# EAGLE design X13_Power_Distribution_B (EAGLE 9.6.2)
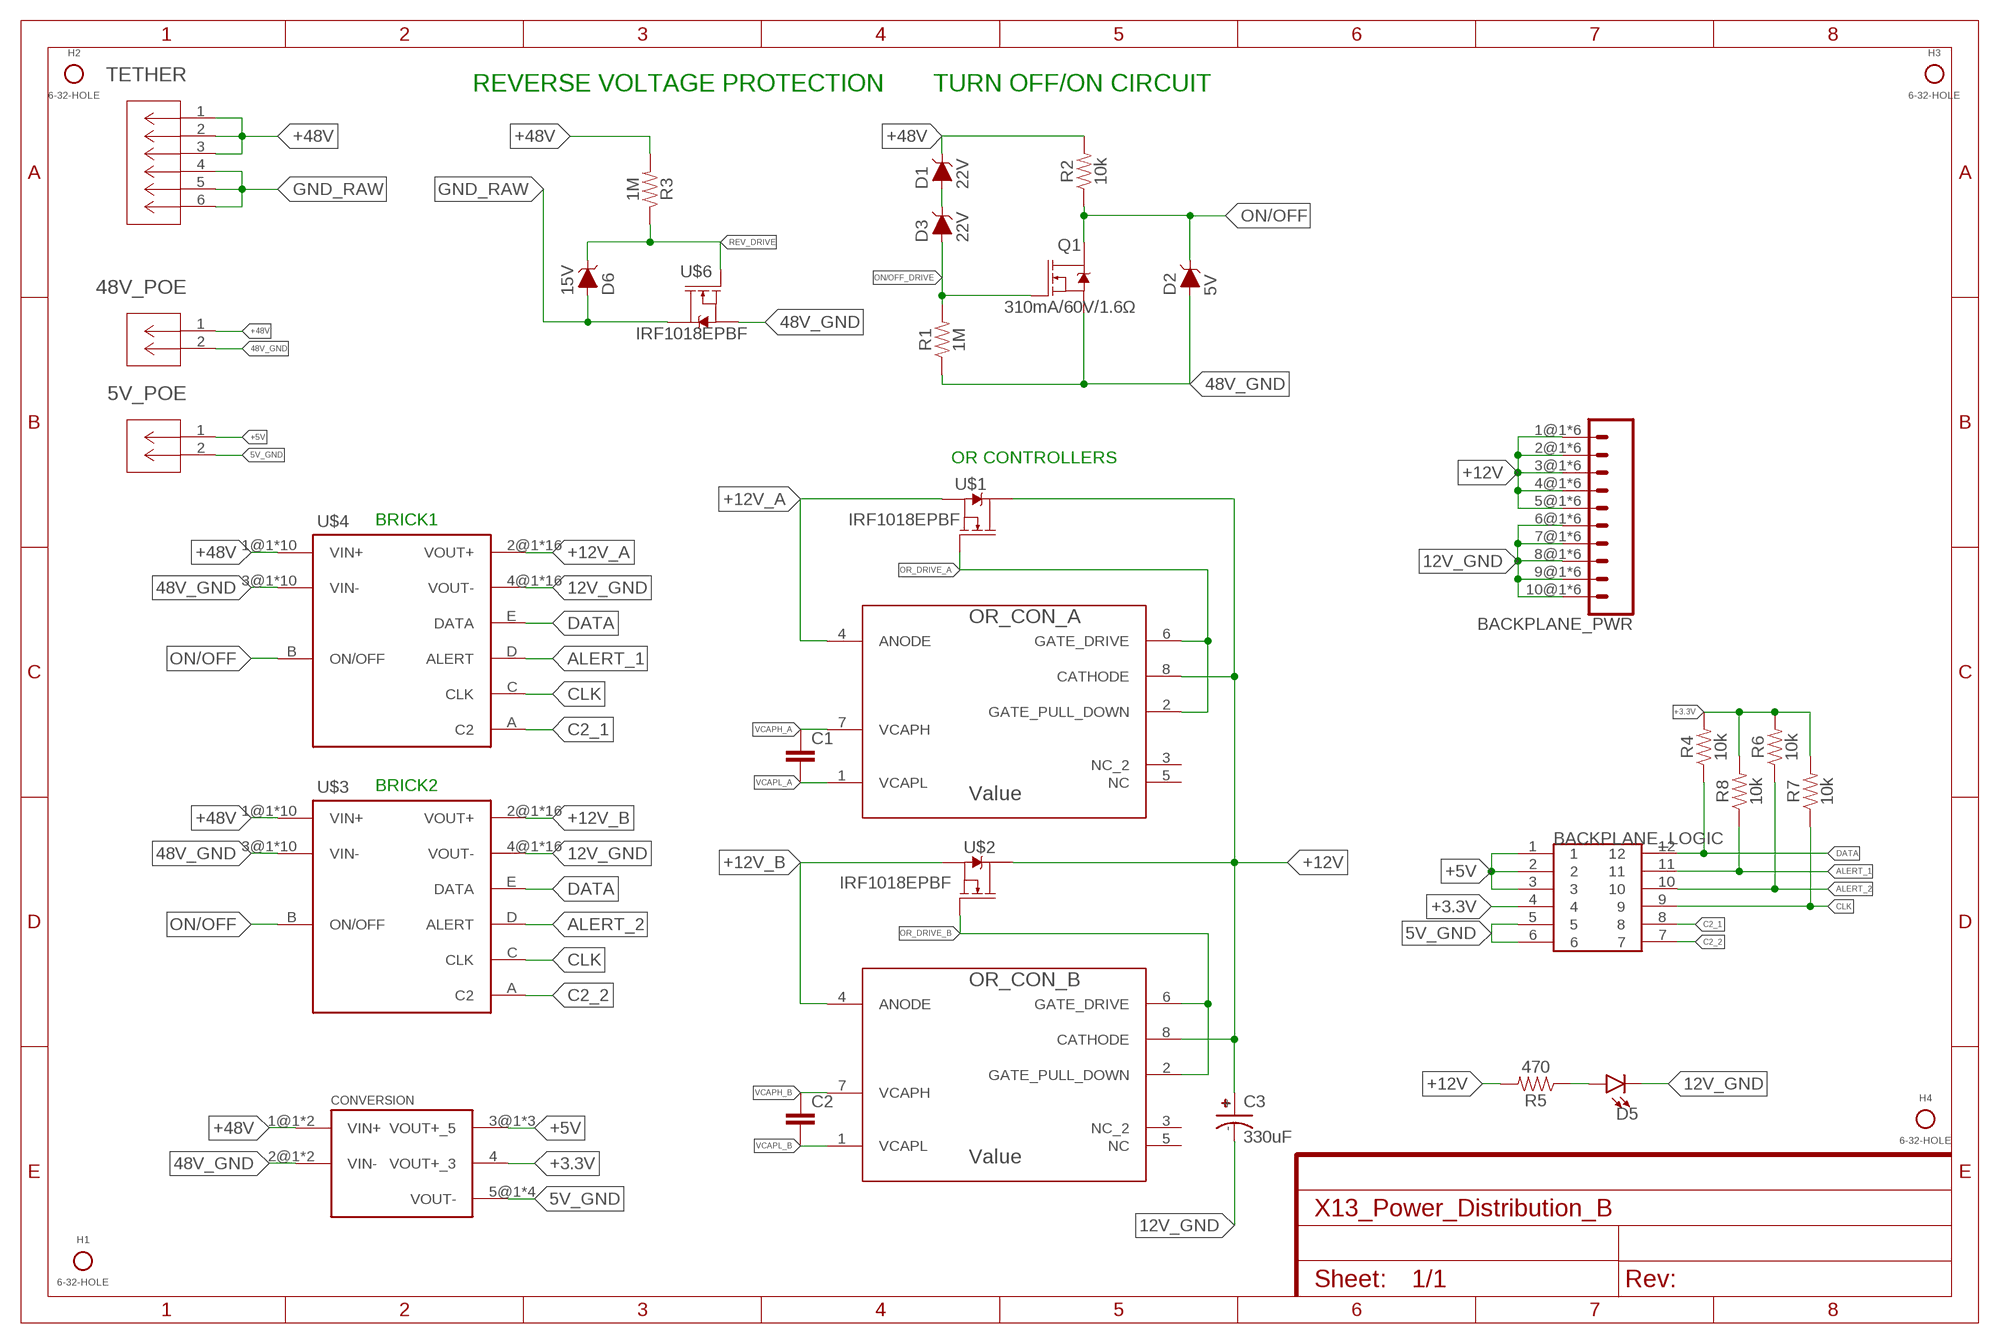
[diagram p0: schematic, sheet 1]

## Parts
5V_POE  POE_TERMINAL  [CONN2_282834-2_TEC]
48V_POE  POE_TERMINAL  [CONN2_282834-2_TEC]
BACKPLANE_LOGIC  IPL1-107-01-L-D-RE-P  [IPL1-107-01-L-D-RE-P]
BACKPLANE_PWR  MPPT-10-01-01-L-RA-SD  [MPPT-10-01-01-L-RA-SD]
C1  0.1UF-0603-100V-10%  [0603]
C2  0.1UF-0603-100V-10%  [0603]
C3  330uF  UCM1H331MNL1GS  [CAPAE1030X1050N]
CONVERSION  DIST2CON  [DIST2CON]
D1  22V  DIODE-ZENER-BZT52C3V6S  [SOD-323]
D2  5V  DIODE-ZENER-BZT52C3V6S  [SOD-323]
D3  22V  DIODE-ZENER-BZT52C3V6S  [SOD-323]
D5  LED0603  [LED-0603]
D6  15V  DIODE-ZENER-BZT52C3V6S  [SOD-323]
H1  6-32-HOLE  [6-32-HOLE]
H2  6-32-HOLE  [6-32-HOLE]
H3  6-32-HOLE  [6-32-HOLE]
H4  6-32-HOLE  [6-32-HOLE]
OR_CON_A  Value  DIST_OR_DIODEDGK0008A_M  [DGK0008A_M]
OR_CON_B  Value  DIST_OR_DIODEDGK0008A_M  [DGK0008A_M]
Q1  310mA/60V/1.6Ω  MOSFET-NCH-2N7002PW  [SOT323]
R1  1M  RESISTOR0603  [0603]
R2  10k  RESISTOR0603  [0603]
R3  1M  RESISTOR0603  [0603]
R4  10k  RESISTOR0603  [0603]
R5  470  RESISTOR0603  [0603]
R6  10k  RESISTOR0603  [0603]
R7  10k  RESISTOR0603  [0603]
R8  10k  RESISTOR0603  [0603]
TETHER  48V  DIST_TO_TETHER  [CON6_P5MM_VER_TERM-BLK_TYC]
U$1  IRF1018EPBF  [TO263]
U$2  IRF1018EPBF  [TO263]
U$3  DIST2BRICK_B  [DIST2BRICK_B]
U$4  DIST2BRICK_B  [DIST2BRICK_B]
U$6  IRF1018EPBF  [TO263]

## Nets
5V_GND: 5V_POE.2 BACKPLANE_LOGIC.5 BACKPLANE_LOGIC.6 CONVERSION.5@1(VOUT-) CONVERSION.5@2(VOUT-) CONVERSION.5@3(VOUT-) CONVERSION.5@4(VOUT-)
12V_GND: BACKPLANE_PWR.6@1 BACKPLANE_PWR.6@2 BACKPLANE_PWR.6@3 BACKPLANE_PWR.6@4 BACKPLANE_PWR.6@5 BACKPLANE_PWR.6@6 BACKPLANE_PWR.7@1 BACKPLANE_PWR.7@2 BACKPLANE_PWR.7@3 BACKPLANE_PWR.7@4 BACKPLANE_PWR.7@5 BACKPLANE_PWR.7@6 BACKPLANE_PWR.8@1 BACKPLANE_PWR.8@2 BACKPLANE_PWR.8@3 BACKPLANE_PWR.8@4 BACKPLANE_PWR.8@5 BACKPLANE_PWR.8@6 BACKPLANE_PWR.9@1 BACKPLANE_PWR.9@2 BACKPLANE_PWR.9@3 BACKPLANE_PWR.9@4 BACKPLANE_PWR.9@5 BACKPLANE_PWR.9@6 BACKPLANE_PWR.10@1 BACKPLANE_PWR.10@2 BACKPLANE_PWR.10@3 BACKPLANE_PWR.10@4 BACKPLANE_PWR.10@5 BACKPLANE_PWR.10@6 C3.- D5.C U$3.4@1(VOUT-) U$3.4@2(VOUT-) U$3.4@3(VOUT-) U$3.4@4(VOUT-) U$3.4@5(VOUT-) U$3.4@6(VOUT-) U$3.4@7(VOUT-) U$3.4@8(VOUT-) U$3.4@9(VOUT-) U$3.4@10(VOUT-) U$3.4@11(VOUT-) U$3.4@12(VOUT-) U$3.4@13(VOUT-) U$3.4@14(VOUT-) U$3.4@15(VOUT-) U$3.4@16(VOUT-) U$4.4@1(VOUT-) U$4.4@2(VOUT-) U$4.4@3(VOUT-) U$4.4@4(VOUT-) U$4.4@5(VOUT-) U$4.4@6(VOUT-) U$4.4@7(VOUT-) U$4.4@8(VOUT-) U$4.4@9(VOUT-) U$4.4@10(VOUT-) U$4.4@11(VOUT-) U$4.4@12(VOUT-) U$4.4@13(VOUT-) U$4.4@14(VOUT-) U$4.4@15(VOUT-) U$4.4@16(VOUT-)
48V_GND: 48V_POE.2 CONVERSION.2@1(VIN-) CONVERSION.2@2(VIN-) D2.A Q1.2(S) R1.1 U$3.3@1(VIN-) U$3.3@2(VIN-) U$3.3@3(VIN-) U$3.3@4(VIN-) U$3.3@5(VIN-) U$3.3@6(VIN-) U$3.3@7(VIN-) U$3.3@8(VIN-) U$3.3@9(VIN-) U$3.3@10(VIN-) U$4.3@1(VIN-) U$4.3@2(VIN-) U$4.3@3(VIN-) U$4.3@4(VIN-) U$4.3@5(VIN-) U$4.3@6(VIN-) U$4.3@7(VIN-) U$4.3@8(VIN-) U$4.3@9(VIN-) U$4.3@10(VIN-) U$6.2(S)
+3.3V: BACKPLANE_LOGIC.4 CONVERSION.4(VOUT+_3) R4.2 R6.2 R7.2 R8.2
+5V: 5V_POE.1 BACKPLANE_LOGIC.1 BACKPLANE_LOGIC.2 BACKPLANE_LOGIC.3 CONVERSION.3@1(VOUT+_5) CONVERSION.3@2(VOUT+_5) CONVERSION.3@3(VOUT+_5)
+12V: BACKPLANE_PWR.1@1 BACKPLANE_PWR.1@2 BACKPLANE_PWR.1@3 BACKPLANE_PWR.1@4 BACKPLANE_PWR.1@5 BACKPLANE_PWR.1@6 BACKPLANE_PWR.2@1 BACKPLANE_PWR.2@2 BACKPLANE_PWR.2@3 BACKPLANE_PWR.2@4 BACKPLANE_PWR.2@5 BACKPLANE_PWR.2@6 BACKPLANE_PWR.3@1 BACKPLANE_PWR.3@2 BACKPLANE_PWR.3@3 BACKPLANE_PWR.3@4 BACKPLANE_PWR.3@5 BACKPLANE_PWR.3@6 BACKPLANE_PWR.4@1 BACKPLANE_PWR.4@2 BACKPLANE_PWR.4@3 BACKPLANE_PWR.4@4 BACKPLANE_PWR.4@5 BACKPLANE_PWR.4@6 BACKPLANE_PWR.5@1 BACKPLANE_PWR.5@2 BACKPLANE_PWR.5@3 BACKPLANE_PWR.5@4 BACKPLANE_PWR.5@5 BACKPLANE_PWR.5@6 C3.+ OR_CON_A.8(CATHODE) OR_CON_B.8(CATHODE) R5.2 U$1.3(D) U$2.3(D)
+12V_A: OR_CON_A.4(ANODE) U$1.2(S) U$4.2@1(VOUT+) U$4.2@2(VOUT+) U$4.2@3(VOUT+) U$4.2@4(VOUT+) U$4.2@5(VOUT+) U$4.2@6(VOUT+) U$4.2@7(VOUT+) U$4.2@8(VOUT+) U$4.2@9(VOUT+) U$4.2@10(VOUT+) U$4.2@11(VOUT+) U$4.2@12(VOUT+) U$4.2@13(VOUT+) U$4.2@14(VOUT+) U$4.2@15(VOUT+) U$4.2@16(VOUT+)
+12V_B: OR_CON_B.4(ANODE) U$2.2(S) U$3.2@1(VOUT+) U$3.2@2(VOUT+) U$3.2@3(VOUT+) U$3.2@4(VOUT+) U$3.2@5(VOUT+) U$3.2@6(VOUT+) U$3.2@7(VOUT+) U$3.2@8(VOUT+) U$3.2@9(VOUT+) U$3.2@10(VOUT+) U$3.2@11(VOUT+) U$3.2@12(VOUT+) U$3.2@13(VOUT+) U$3.2@14(VOUT+) U$3.2@15(VOUT+) U$3.2@16(VOUT+)
+48V: 48V_POE.1 CONVERSION.1@1(VIN+) CONVERSION.1@2(VIN+) D1.C R2.2 R3.2 TETHER.1 TETHER.2 TETHER.3 U$3.1@1(VIN+) U$3.1@2(VIN+) U$3.1@3(VIN+) U$3.1@4(VIN+) U$3.1@5(VIN+) U$3.1@6(VIN+) U$3.1@7(VIN+) U$3.1@8(VIN+) U$3.1@9(VIN+) U$3.1@10(VIN+) U$4.1@1(VIN+) U$4.1@2(VIN+) U$4.1@3(VIN+) U$4.1@4(VIN+) U$4.1@5(VIN+) U$4.1@6(VIN+) U$4.1@7(VIN+) U$4.1@8(VIN+) U$4.1@9(VIN+) U$4.1@10(VIN+)
ALERT_1: BACKPLANE_LOGIC.11 R8.1 U$4.D(ALERT)
ALERT_2: BACKPLANE_LOGIC.10 R6.1 U$3.D(ALERT)
C2_1: BACKPLANE_LOGIC.8 U$4.A(C2)
C2_2: BACKPLANE_LOGIC.7 U$3.A(C2)
CLK: BACKPLANE_LOGIC.9 R7.1 U$3.C(CLK) U$4.C(CLK)
DATA: BACKPLANE_LOGIC.12 R4.1 U$3.E(DATA) U$4.E(DATA)
GND_RAW: D6.A TETHER.4 TETHER.5 TETHER.6 U$6.3(D)
N$1: D1.A D3.C
N$8: D5.A R5.1
ON/OFF: D2.C Q1.3(D) R2.1 U$3.B(ON/OFF) U$4.B(ON/OFF)
ON/OFF_DRIVE: D3.A Q1.1(G) R1.2
OR_DRIVE_A: OR_CON_A.2(GATE_PULL_DOWN) OR_CON_A.6(GATE_DRIVE) U$1.1(G)
OR_DRIVE_B: OR_CON_B.2(GATE_PULL_DOWN) OR_CON_B.6(GATE_DRIVE) U$2.1(G)
REV_DRIVE: D6.C R3.1 U$6.1(G)
VCAPH_A: C1.1 OR_CON_A.7(VCAPH)
VCAPH_B: C2.1 OR_CON_B.7(VCAPH)
VCAPL_A: C1.2 OR_CON_A.1(VCAPL)
VCAPL_B: C2.2 OR_CON_B.1(VCAPL)
Unconnected: OR_CON_A.3(NC_2) OR_CON_A.5(NC) OR_CON_B.3(NC_2) OR_CON_B.5(NC)

## Notes on the sheet
- REVERSE VOLTAGE PROTECTION | TURN OFF/ON CIRCUIT
- OR CONTROLLERS
- BRICK1
- BRICK2

## Library data of the parts
5V_POE 48V_POE = Dist_POE:POE_TERMINAL; BUILT_BY: EMA_UL_Team; COPYRIGHT: Copyright (C) 2016 Accelerated Designs. All rights reserved; DESCRIPTION: TERMI-BLOK PCB MOUNT, 90 2P.; MANUFACTURER_PART_NUMBER: 282834-2; PITCH_MM_: 2.54; POSITIONS: 2; PRODUCT: Terminal Block Headers & Receptacles; ROWS-CONFIG: 1; SOURCELIBRARY: TE_Connectivity-2018-03-16; TE_PART_NUMBER: 282834-2; TYPE: Receptacle; VENDOR: TE Connectivity
BACKPLANE_LOGIC = Backplane_Dist_Logic_Connector:IPL1-107-01-L-D-RE-P
BACKPLANE_PWR = Samtec MPPT Hermaphoditic 10 pos - MPPT-10-01-01-L-RA-SD:MPPT-10-01-01-L-RA-SD: Samtec MPPT Connector Right Angle Vertically mating Non-gendered https://www.samtec.com/products/mppt-10-01-01-l-ra-sd
C1 C2 = SparkFun-Capacitors:0.1UF: 0.1µF ceramic capacitors A capacitor is a passive two-terminal electrical component used to store electrical energy temporarily in an electric field.; PROD_ID: CAP-08390; VALUE: 0.1uF
C3 = brick-capacitor-UCM1H331MNL1GS:UCM1H331MNL1GS: Nichicon 330uF 50 V Aluminium Electrolytic Capacitor SMD, CM Series 2000h 10 (Dia.) x 10mm Source: Datasheet <http://www.nichicon.co.jp/english/products/pdfs/e-ucm.pdf>; ARROW_PART_NUMBER: UCM1H331MNL1GS; ARROW_PRICE-STOCK: https://www.arrow.com/en/products/ucm1h331mnl1gs/nichicon; DESCRIPTION: Nichicon 330uF 50 V Aluminium Electrolytic Capacitor SMD, CM Series 2000h 10 (Dia.) x 10mm; HEIGHT: 10.5mm; MANUFACTURER_NAME: Nichicon; MANUFACTURER_PART_NUMBER: UCM1H331MNL1GS; MOUSER_PART_NUMBER: 647-UCM1H331MNL1GS; MOUSER_PRICE-STOCK: https://www.mouser.co.uk/ProductDetail/Nichicon/UCM1H331MNL1GS?qs=DSgADHjnLTkTovFLdbC%252BNg%3D%3D
CONVERSION = Dist_Convert_Connector:DIST2CON
D1-D3 D6 = SparkFun-DiscreteSemi:DIODE-ZENER: Zener Diode A Zener diode allows current to flow from its anode to its cathode like a normal semiconductor diode, but it also permits current to flow in the reverse direction when its "Zener voltage" is reached. - WIkipedia; PROD_ID: DIO-08199; VALUE: 3.6V
D5 = SparkFun-LED:LED: LED (Generic) Standard schematic elements and footprints for 5mm, 3mm, 1206, and 0603 sized LEDs. Generic LEDs with no color specified.
H1-H4 = Mounting Holes:6-32-HOLE
OR_CON_A OR_CON_B = Dist_OR_Controller:DIST_OR_DIODE; APPLICATION_BUILDNUMBER: *; COMPTYPE: IC; MANUFACTURER: Texas Instruments; MOUNTTYPE: SMT; PACKAGEREFERENCE: DGK0008A; PARTNUMBER: LM74610QDGKRQ1; PIN_COUNT: 8; REFDES: RefDes; TYPE: TYPE
Q1 = SparkFun-DiscreteSemi:MOSFET-NCH: N-channel MOSFETs Voltage controlled devices that allow control of high current outputs. SparkFun Products: SparkFun OpenScale <https://www.sparkfun.com/products/13261> SparkFun Digital Sandbox <https://www.sparkfun.com/products/12651> SparkFun Monster Moto Shield <https://www.sparkfun.com/products/10182> SparkFun MOSFET Power Controller <https://www.sparkfun.com/products/11214>; PROD_ID: TRANS-11151
R1 R2 = SparkFun-Resistors:RESISTOR: Generic Resistor Package; SPICEPREFIX: R
R3-R8 = SparkFun-Resistors:RESISTOR: Generic Resistor Package
TETHER = Dist_To_Tether_Connector:DIST_TO_TETHER; BUILT_BY: EMA_UL_Team; MANUFACTURER_PART_NUMBER: 796636-6; SOURCELIBRARY: Tyco_2012-04-26; VENDOR: TE Connectivity
U$1 U$2 U$6 = Reverse_Voltage_NMOS:IRF1018EPBF
U$3 U$4 = Brick_Dist_Connector:DIST2BRICK_B

## Net classes
0 default: width 0.203 mm, clearance 0.205 mm

## Board
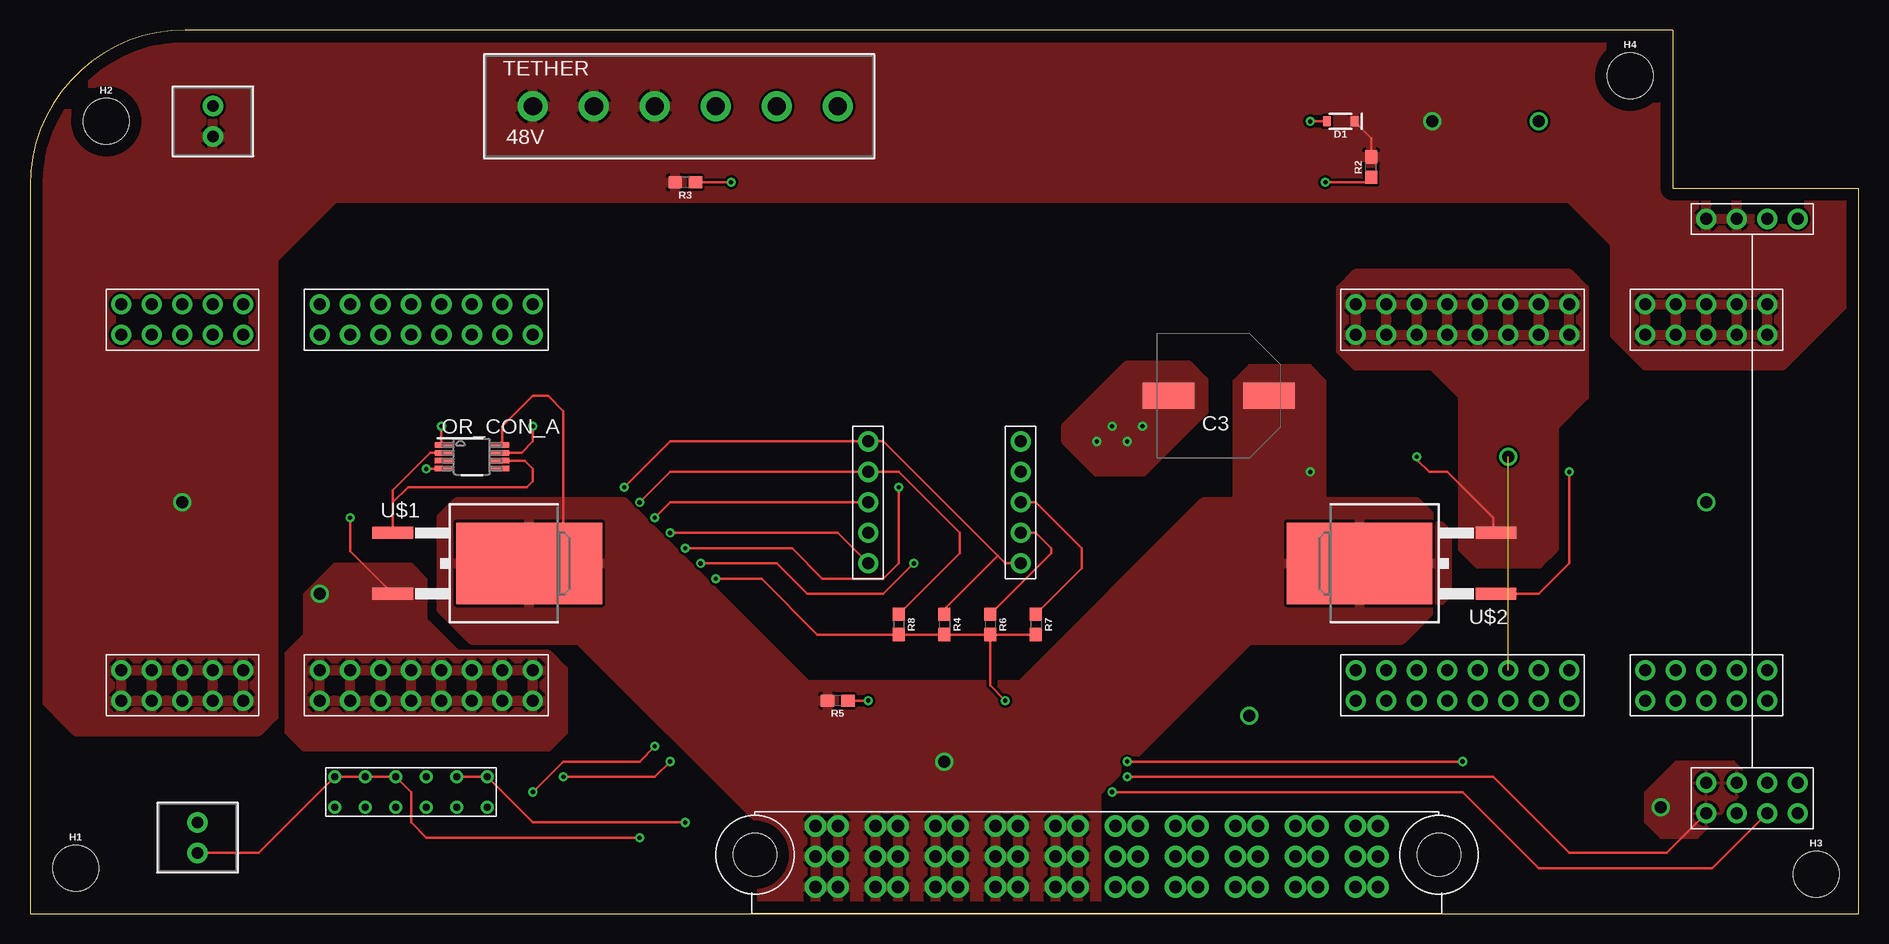
[diagram p1: board, top side]
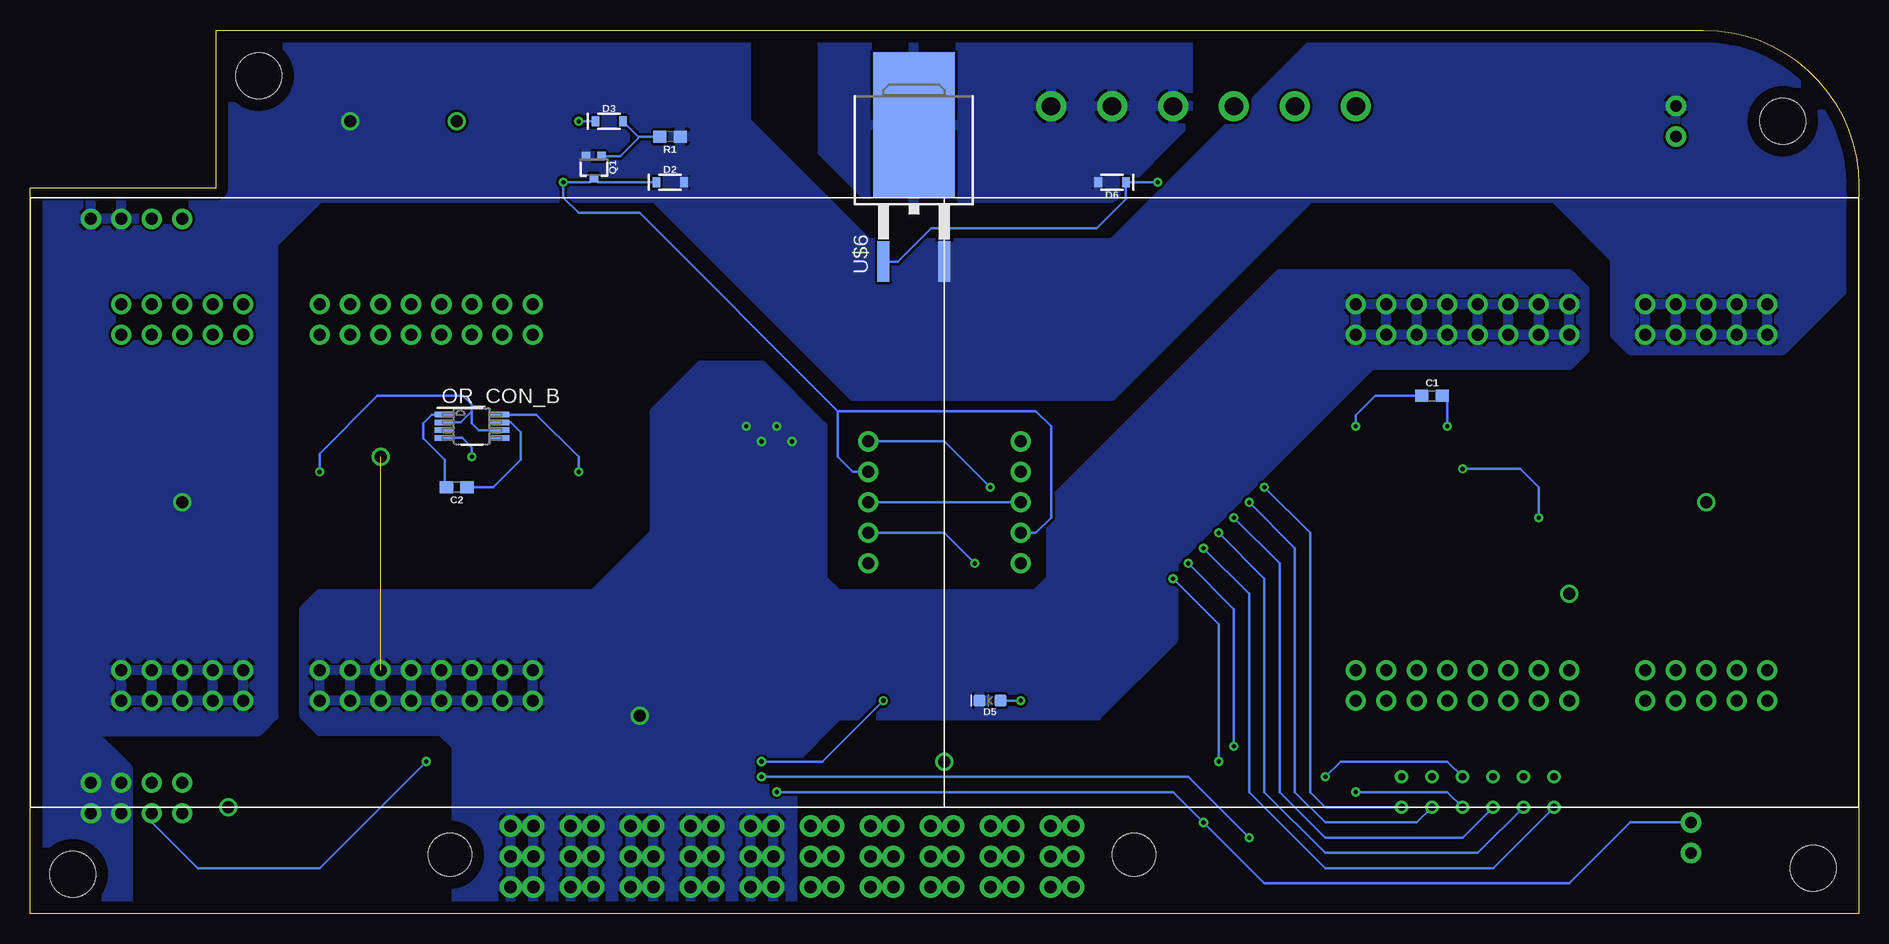
[diagram p2: board, bottom side, seen from below]

Size 152.4 x 73.66 mm. Coordinates in mm from the lower left corner, seen from the top.
Outline: 0,0 152.4,0 152.4,60.45 136.91,60.45 136.91,73.66 12.95,73.66 arc90 0,60.71 0,0
Copper layers (1*16): Top 0.035mm / dielectric 1.5mm / Bottom 0.035mm
Design rules "default": minimum track width 6mil, minimum drill 0.35mm, track to track 6mil, track to pad 6mil, pad to pad 6mil, via to via 6mil, smd to smd 6mil, copper to edge 40mil, drill to drill 6mil, minimum pad ring 10mil, minimum via ring 8mil, stop-mask expansion 4mil, vias tented up to drill 0mil, thermal gap 10mil

### Footprints (pad centres in the part's own frame; a part is rotated, then mirrored left to right if it is on the bottom)
CONN2_282834-2_TEC = drill 0.965 pad 1.7: 1 0,0; 2 2.54,0
IPL1-107-01-L-D-RE-P = drill 0.6: 1 0,0; 2 2.54,0; 3 5.08,0; 4 7.62,0; 5 10.16,0; 6 12.7,0; 7 0,-2.54; 8 2.54,-2.54; 9 5.08,-2.54; 10 7.62,-2.54; 11 10.16,-2.54; 12 12.7,-2.54
MPPT-10-01-01-L-RA-SD = drill 1.04 pad 1.8: 1@1 -23.44,2.26; 1@2 -21.56,2.26; 1@3 -23.44,4.8; 1@4 -21.56,4.8; 1@5 -23.44,7.34; 1@6 -21.56,7.34; 2@1 -18.44,2.26; 2@2 -16.56,2.26; 2@3 -18.44,4.8; 2@4 -16.56,4.8; 2@5 -18.44,7.34; 2@6 -16.56,7.34; 3@1 -13.44,2.26; 3@2 -11.56,2.26; 3@3 -13.44,4.8; 3@4 -11.56,4.8; 3@5 -13.44,7.34; 3@6 -11.56,7.34; 4@1 -8.44,2.26; 4@2 -6.56,2.26; 4@3 -8.44,4.8; 4@4 -6.56,4.8; 4@5 -8.44,7.34; 4@6 -6.56,7.34; 5@1 -3.44,2.26; 5@2 -1.56,2.26; 5@3 -3.44,4.8; 5@4 -1.56,4.8; 5@5 -3.44,7.34; 5@6 -1.56,7.34; 6@1 1.56,2.26; 6@2 3.44,2.26; 6@3 1.56,4.8; 6@4 3.44,4.8; 6@5 1.56,7.34; 6@6 3.44,7.34; 7@1 6.56,2.26; 7@2 8.44,2.26; 7@3 6.56,4.8; 7@4 8.44,4.8; 7@5 6.56,7.34; 7@6 8.44,7.34; 8@1 11.56,2.26; 8@2 13.44,2.26; 8@3 11.56,4.8; 8@4 13.44,4.8; 8@5 11.56,7.34; 8@6 13.44,7.34; 9@1 16.56,2.26; 9@2 18.44,2.26; 9@3 16.56,4.8; 9@4 18.44,4.8; 9@5 16.56,7.34; 9@6 18.44,7.34; 10@1 21.56,2.26; 10@2 23.44,2.26; 10@3 21.56,4.8; 10@4 23.44,4.8; 10@5 21.56,7.34; 10@6 23.44,7.34 | hole 3.6: 28.5,4.93; -28.5,4.93
0603 = smd 1.1 x 1: 1 -0.85,0; 2 0.85,0
CAPAE1030X1050N = smd 4.3 x 2.15: + -4.2,0; - 4.2,0
DIST2CON = drill 1 pad 1.676: 1@1 -3.81,22.86; 1@2 -1.27,22.86; 2@1 1.27,22.86; 2@2 3.81,22.86; 3@1 -3.81,-26.67; 3@2 -3.81,-24.13; 3@3 -1.27,-24.13; 4 -1.27,-26.67; 5@1 1.27,-26.67; 5@2 1.27,-24.13; 5@3 3.81,-26.67; 5@4 3.81,-24.13
SOD-323 = smd 0.63 x 0.83: A 1.15,0; C -1.15,0
LED-0603 = smd 1 x 1: A -0.877,0; C 0.877,0
6-32-HOLE = hole 3.81: 0,0
DGK0008A_M = smd 1.55 x 0.45: 1 -2.325,0.975; 2 -2.325,0.325; 3 -2.325,-0.325; 4 -2.325,-0.975; 5 2.325,-0.975; 6 2.325,-0.325; 7 2.325,0.325; 8 2.325,0.975
SOT323 = smd 0.7 x 0.7: 1 -0.65,-0.925; 2 0.65,-0.925; 3 0,0.925
CON6_P5MM_VER_TERM-BLK_TYC = drill 1.524 pad 2.5: 1 0,0; 2 5.08,0; 3 10.16,0; 4 15.24,0; 5 20.32,0; 6 25.4,0
TO263 = smd 1 x 3.4: 1 -2.54,-6.6; 2 2.54,-6.6 | smd 6.8 x 12.14: 3 0,4.77
DIST2BRICK_B = drill 1 pad 1.676: 1@1 -30.48,-16.51; 1@2 -30.48,-13.97; 1@3 -27.94,-16.51; 1@4 -27.94,-13.97; 1@5 -25.4,-16.51; 1@6 -25.4,-13.97; 1@7 -22.86,-16.51; 1@8 -22.86,-13.97; 1@9 -20.32,-16.51; 1@10 -20.32,-13.97; 2@1 -13.97,-16.51; 2@2 -13.97,-13.97; 2@3 -11.43,-16.51; 2@4 -11.43,-13.97; 2@5 -8.89,-16.51; 2@6 -8.89,-13.97; 2@7 -6.35,-16.51; 2@8 -6.35,-13.97; 2@9 -3.81,-16.51; 2@10 -3.81,-13.97; 2@11 -1.27,-16.51; 2@12 -1.27,-13.97; 2@13 1.27,-16.51; 2@14 1.27,-13.97; 2@15 3.81,-16.51; 2@16 3.81,-13.97; 3@1 -30.48,13.97; 3@2 -30.48,16.51; 3@3 -27.94,13.97; 3@4 -27.94,16.51; 3@5 -25.4,13.97; 3@6 -25.4,16.51; 3@7 -22.86,13.97; 3@8 -22.86,16.51; 3@9 -20.32,13.97; 3@10 -20.32,16.51; 4@1 -13.97,13.97; 4@2 -13.97,16.51; 4@3 -11.43,13.97; 4@4 -11.43,16.51; 4@5 -8.89,13.97; 4@6 -8.89,16.51; 4@7 -6.35,13.97; 4@8 -6.35,16.51; 4@9 -3.81,13.97; 4@10 -3.81,16.51; 4@11 -1.27,13.97; 4@12 -1.27,16.51; 4@13 1.27,13.97; 4@14 1.27,16.51; 4@15 3.81,13.97; 4@16 3.81,16.51; A 31.75,-5.08; B 31.75,-2.54; C 31.75,0; D 31.75,2.54; E 31.75,5.08

### Placement (x,y rotation side)
5V_POE  13.97,5.08 90 top
48V_POE  15.24,64.77 90 top
BACKPLANE_LOGIC  25.4,11.43 0 top
BACKPLANE_PWR  88.9,0 0 top
C1  35.56,43.18 0 bottom
C2  116.84,35.56 180 bottom
C3  99.06,43.18 180 top
CONVERSION  143.51,35.05 0 top
D1  109.22,66.04 180 top
D2  99.06,60.96 0 bottom
D3  104.14,66.04 0 bottom
D5  72.39,17.78 180 bottom
D6  62.23,60.96 180 bottom
H1  3.81,3.81 0 top
H2  6.35,66.04 0 top
H3  148.84,3.3 0 top
H4  133.35,69.85 0 top
OR_CON_A  36.83,38.1 0 top
OR_CON_B  115.57,40.64 0 bottom
Q1  105.41,62.23 180 bottom
R1  99.06,64.77 180 bottom
R2  111.76,62.23 90 top
R3  54.61,60.96 180 top
R4  76.2,24.13 270 top
R5  67.31,17.78 180 top
R6  80.01,24.13 270 top
R7  83.82,24.13 270 top
R8  72.39,24.13 270 top
TETHER  41.91,67.31 0 top
U$1  36.83,29.21 270 top
U$2  115.57,29.21 90 top
U$3  114.3,34.29 180 top
U$4  38.1,34.29 0 top
U$6  78.74,60.96 0 bottom

### Tracks (layer width: path | path; a pad name or v marks a point on that pad's centre or on a via)
5V_GND  (via drill 0.35)
  Top 0.203: CONVERSION.5@1 140.21,3.81 125.73,3.81 119.38,10.16 v90.17,10.16 | v54.61,7.62 41.91,7.62 BACKPLANE_LOGIC.6 BACKPLANE_LOGIC.5
  Bottom 0.203: v90.17,10.16 57.15,10.16 v54.61,7.62 49.53,2.54 24.13,2.54 19.05,7.62 5V_POE.2
  pour Bottom (no thermals): 144.27,12.19 144.27,-0.76 147.32,-3.81 151.13,-3.81 156.21,1.27 156.21,25.4 153.67,27.94 148.59,27.94 147.32,26.67 147.32,15.24
12V_GND  (via drill 0.35, 1)  (1 unrouted)
  other vias: 92.71,40.64 91.44,39.37 90.17,40.64 88.9,39.37 101.6,16.51 123.19,38.1
  pour Bottom: 88.9,-1.27 92.71,-5.08 111.76,-5.08 116.84,0 116.84,13.97 118.11,15.24 128.27,15.24 129.54,16.51 129.54,25.4 128.27,26.67 105.41,26.67 100.33,31.75 100.33,41.91 96.52,45.72 91.44,45.72 86.36,40.64 86.36,27.94 85.09,26.67 68.58,26.67 67.31,27.94 67.31,34.29 48.26,53.34 24.13,53.34 22.86,52.07 22.86,46.99 24.13,45.72 40.64,45.72 57.15,29.21 57.15,22.86 63.5,16.51 85.09,16.51 88.9,12.7
  pour Top (no thermals): 86.36,40.64 91.44,45.72 96.52,45.72 97.79,44.45 97.79,41.91 92.71,36.83 88.9,36.83 86.36,39.37
48V_GND  (via drill 1)
  other vias: 125.73,66.04 139.7,34.29
  pour Bottom: 20.32,48.26 19.05,46.99 6.35,46.99 -3.81,57.15 -3.81,67.31 6.35,77.47 40.64,77.47 62.23,55.88 82.55,55.88 92.71,66.04 92.71,74.93 95.25,77.47 144.78,77.47 156.21,66.04 156.21,22.86 148.59,15.24 133.35,15.24 132.08,16.51 132.08,55.88 128.27,59.69 100.33,59.69 83.82,43.18 62.23,43.18 45.72,59.69 25.4,59.69 20.32,54.61
  pour Bottom (no thermals): 73.66,54.61 74.93,55.88 77.47,55.88 78.74,54.61 78.74,53.34 77.47,52.07 74.93,52.07 73.66,53.34
+3.3V  (via drill 0.35)
  Top 0.203: R6.2 R4.2 R8.2 65.62,23.28 60.96,27.94 v57.15,27.94 | R6.2 R7.2 | R6.2 80.01,19.05 v81.28,17.78 | v119.38,12.7 v91.44,12.7 | v53.34,12.7 52.07,11.43 v44.45,11.43
  Bottom 0.203: v119.38,12.7 128.27,3.81 138.43,3.81 142.24,7.62 CONVERSION.4 | v91.44,12.7 86.36,12.7 v81.28,17.78 | v57.15,27.94 53.34,24.13 v53.34,12.7 | v44.45,11.43 43.18,12.7 34.29,12.7 BACKPLANE_LOGIC.4
+5V  (via drill 0.35, 1)
  Top 0.203: CONVERSION.3@1 136.4,5.08 128.27,5.08 121.92,11.43 v91.44,11.43 | v50.8,6.35 33.02,6.35 31.75,7.62 31.75,10.16 BACKPLANE_LOGIC.3 BACKPLANE_LOGIC.2 BACKPLANE_LOGIC.1 19.05,5.08 5V_POE.1
  Bottom 0.203: v91.44,11.43 55.88,11.43 v50.8,6.35
  other vias: 135.89,8.89
  pour Top: 138.94,6.35 143,10.41 143,11.68 141.99,12.7 137.16,12.7 134.62,10.16 134.62,7.62 135.89,6.35
+12V  (via drill 0.35, 1)
  Top 0.203: OR_CON_A.8 39.37,39.39 39.37,40.64 41.91,43.18 43.18,43.18 44.45,41.91 44.45,30.48 43.18,29.21 | U$2.3 109.22,30.79
  Bottom 0.203: v106.68,36.83 106.68,38.1 110.19,41.62 OR_CON_B.8
  other vias: 76.2,12.7
  pour Top: 34.29,25.4 36.83,22.86 45.72,22.86 60.96,7.62 60.96,1.27 67.31,-5.08 85.09,-5.08 88.9,-1.27 88.9,10.16 101.6,22.86 114.3,22.86 118.11,26.67 118.11,31.75 115.57,34.29 97.79,34.29 82.55,19.05 64.77,19.05 49.53,34.29 35.56,34.29 34.29,33.02
  pour Top (no thermals): 100.33,34.29 100.33,44.45 101.6,45.72 106.68,45.72 107.95,44.45 107.95,34.29 106.68,33.02 101.6,33.02
+12V_A  (via drill 0.35, 1)
  Top 0.203: U$1.2 26.67,30.23 v26.67,33.02 | v33.02,37.08 34.46,37.08 OR_CON_A.4
  Bottom 0.203: v26.67,33.02 26.67,35.56 28.19,37.08 v33.02,37.08
  other vias: 24.13,26.67
  pour Top: 22.86,13.97 43.18,13.97 44.45,15.24 44.45,20.32 43.18,21.59 35.56,21.59 33.02,24.13 24.13,24.13 21.59,21.59 21.59,15.24
  pour Top (no thermals): 24.13,21.59 22.86,22.86 22.86,26.67 25.4,29.21 31.75,29.21 33.02,27.94 33.02,22.86 31.75,21.59
+12V_B  (via drill 0.35)
  Top 0.203: U$2.2 121.92,32 121.92,33.02 118.11,36.83 116.59,36.83 115.57,37.85 v115.57,38.1
  Bottom 0.203: v115.57,38.1 115.57,38.86 116.37,39.66 OR_CON_B.4
  pour Top: 127,40.64 129.54,43.18 129.54,52.07 128.27,53.34 110.49,53.34 109.22,52.07 109.22,46.99 110.49,45.72 116.84,45.72 119.38,43.18 119.38,30.48 120.65,29.21 125.73,29.21 127,30.48
  pour Top (no thermals): 119.38,33.02 120.65,34.29 124.46,34.29 125.73,33.02 125.73,30.48 124.46,29.21 120.65,29.21 119.38,30.48
+48V  (via drill 1)
  Top 0.203: D1.C 111.76,64.65 R2.2
  other vias: 116.84,66.04 12.7,34.29
  pour Top: 19.05,15.24 20.32,16.51 20.32,54.61 25.4,59.69 128.27,59.69 132.08,55.88 132.08,48.26 134.62,45.72 146.05,45.72 154.94,54.61 154.94,69.85 148.59,76.2 3.81,76.2 -2.54,69.85 -2.54,21.59 3.81,15.24
ALERT_1  (via drill 0.35)
  Top 0.203: v50.8,34.29 53.34,36.83 U$4.D 72.39,36.83 77.47,31.75 77.47,30.06 R8.1
  Bottom 0.203: v50.8,34.29 46.99,30.48 46.99,10.16 44.45,7.62 36.83,7.62 BACKPLANE_LOGIC.11
ALERT_2  (via drill 0.35)
  Top 0.203: R6.1 85.09,30.06 85.09,30.48 83.82,31.75 U$3.D | v55.88,29.21 62.23,29.21 64.77,26.67 71.12,26.67 v73.66,29.21 | v52.07,13.97 50.8,12.7 44.45,12.7 v41.91,10.16
  Bottom 0.203: v55.88,29.21 52.07,25.4 v52.07,13.97 | v41.91,10.16 34.29,10.16 BACKPLANE_LOGIC.10 | U$3.D 76.2,31.75 v73.66,29.21
C2_1  (via drill 0.35)
  Top 0.203: U$4.A 67.31,31.75 v53.34,31.75
  Bottom 0.203: v53.34,31.75 49.53,27.94 49.53,10.16 44.45,5.08 31.75,5.08 BACKPLANE_LOGIC.8
C2_2  (via drill 0.35)
  Top 0.203: v54.61,30.48 63.5,30.48 66.04,27.94 71.12,27.94 72.39,29.21 v72.39,35.56
  Bottom 0.203: BACKPLANE_LOGIC.7 30.48,3.81 44.45,3.81 50.8,10.16 50.8,26.67 v54.61,30.48 | v72.39,35.56 76.2,39.37 U$3.A
CLK  (via drill 0.35)
  Top 0.203: R7.1 87.63,28.79 87.63,30.48 83.82,34.29 U$3.C | U$4.C 53.34,34.29 v52.07,33.02
  Bottom 0.203: v52.07,33.02 48.26,29.21 48.26,10.16 44.45,6.35 33.02,6.35 BACKPLANE_LOGIC.9 | U$4.C U$3.C
DATA  (via drill 0.35)
  Top 0.203: U$3.E 81.28,29.21 80.64,29.84 | R4.1 76.2,25.4 80.64,29.84 | v49.53,35.56 53.34,39.37 U$4.E 71.12,39.37 80.64,29.84
  Bottom 0.203: BACKPLANE_LOGIC.12 44.45,8.89 45.72,10.16 45.72,31.75 v49.53,35.56
GND_RAW
  pour Bottom: 55.88,66.04 55.88,73.66 59.69,77.47 83.82,77.47 86.36,74.93 86.36,63.5 82.55,59.69 62.23,59.69
N$1  (via drill 0.35)
  Top 0.203: v106.68,66.04 D1.A
  Bottom 0.203: D3.C v106.68,66.04
N$8  (via drill 0.35)
  Top 0.203: R5.1 v69.85,17.78
  Bottom 0.203: v69.85,17.78 D5.A
ON/OFF  (via drill 0.35)
  Top 0.203: v107.95,60.96 111.34,60.96 R2.1
  Bottom 0.203: D2.C 105.06,60.96 Q1.3 105.75,60.96 v107.95,60.96 107.95,59.69 106.68,58.42 101.6,58.42 85.09,41.91 | 85.09,41.91 68.58,41.91 67.31,40.64 67.31,33.02 68.58,31.75 U$4.B | 85.09,41.91 85.09,38.1 83.82,36.83 U$3.B
ON/OFF_DRIVE
  Bottom 0.203: Q1.1 103.22,63.16 101.6,64.77 | D3.A 101.72,64.77 101.6,64.77 | R1.2 101.6,64.77
OR_DRIVE_A
  Top 0.203: OR_CON_A.2 33.34,38.42 30.23,35.31 30.23,34.29 | 30.23,34.29 U$1.1 | 30.23,34.29 31.5,35.56 41.4,35.56 41.91,36.07 41.91,37.08 41.22,37.77 OR_CON_A.6
OR_DRIVE_B  (via drill 0.35)
  Top 0.203: U$2.1 125.73,26.67 128.27,29.21 v128.27,36.83
  Bottom 0.203: v128.27,36.83 128.27,38.35 123.44,43.18 116.33,43.18 115.57,42.42 115.57,41.91 | OR_CON_B.2 116.52,40.97 115.57,41.91 | OR_CON_B.6 114.99,40.31 115.57,40.89 115.57,41.91
REV_DRIVE  (via drill 0.35)
  Top 0.203: R3.1 v58.42,60.96
  Bottom 0.203: v58.42,60.96 D6.C 61.08,59.57 63.5,57.15 77.31,57.15 80.1,54.36 U$6.1
VCAPH_A  (via drill 0.35)
  Top 0.203: OR_CON_A.7 40.97,38.42 41.91,39.37 v41.91,40.64
  Bottom 0.203: v41.91,40.64 41.91,41.57 40.3,43.18 C1.1
VCAPH_B
  Bottom 0.203: C2.1 113.79,35.56 111.51,37.85 111.51,40.13 112.34,40.97 OR_CON_B.7
VCAPL_A  (via drill 0.35)
  Top 0.203: OR_CON_A.1 34.29,39.39 v34.29,40.64
  Bottom 0.203: v34.29,40.64 34.29,42.76 C1.2
VCAPL_B
  Bottom 0.203: C2.2 117.86,35.73 117.86,37.85 119.63,39.62 119.63,40.89 118.91,41.62 OR_CON_B.1

### Text on the board
tValues: +48V | 48V_GND | +12V_B | +48V | 48V_GND | +12V_A | 12V_GND | +12V | +5V